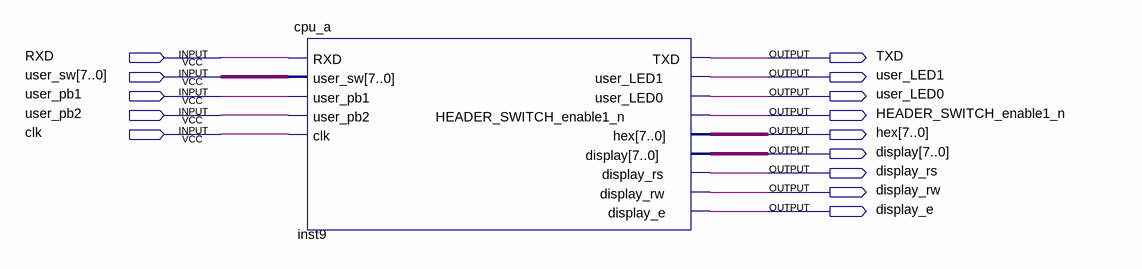
[diagram p0: schematic sheet]
// Quartus schematic niosapex.bdf as structural Verilog: 1 symbols, 14 pins
module niosapex (
  input  RXD,
  input  [7:0] user_sw,
  input  user_pb1,
  input  user_pb2,
  input  clk,
  output TXD,
  output user_LED1,
  output user_LED0,
  output HEADER_SWITCH_enable1_n,
  output [7:0] hex,
  output [7:0] display,
  output display_rs,
  output display_rw,
  output display_e
);

  cpu_a inst9 (
    .RXD(RXD), .user_sw(user_sw), .user_pb1(user_pb1), .user_pb2(user_pb2), .clk(clk), .TXD(TXD),
    .user_LED1(user_LED1), .user_LED0(user_LED0), .HEADER_SWITCH_enable1_n(HEADER_SWITCH_enable1_n),
    .hex(hex), .display(display), .display_rs(display_rs), .display_rw(display_rw), .display_e(display_e));
endmodule
